# Altium project CCS_v4.PrjPcb
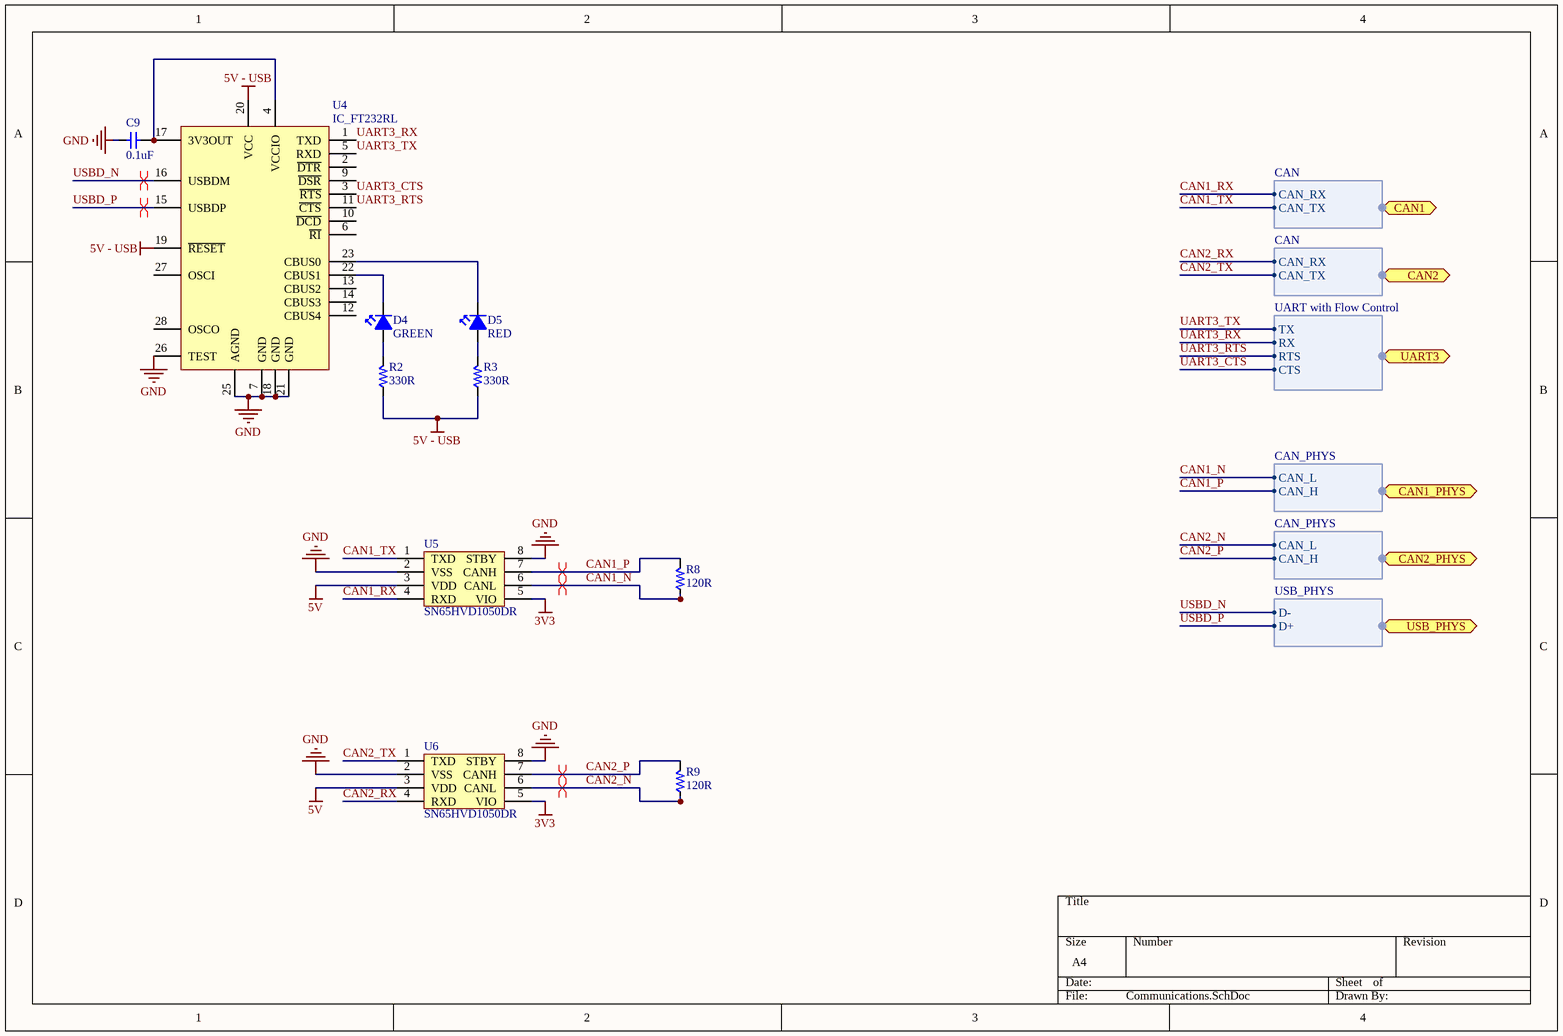
[diagram p0: Communications.SchDoc]
5 sheets, 78 parts. Net scope: flat (ports and power ports of the same name join across sheets).
Board file: CCS_V4.0.PcbDoc
Sheets:
  Communications.SchDoc
  Connectors.SchDoc
  MCU.SchDoc
  Power.SchDoc
  12V Input Circuitry.SchDoc

## Sheet Communications.SchDoc
size A4

### Parts
C9  value 0.1uF  [PCB_GENERIC_SMD_0603]  (hidden comment: C060-000U1-00)
D4  Color: GREEN  [SMD_0603_LED]  (hidden comment: D060-000G2-00)
D5  Color: RED  [SMD_0603_LED]  (hidden comment: D060-000R2-00)
R2  value 330R  [PCB_GENERIC_SMD_0603]  (hidden comment: R060-00331-05)
R3  value 330R  [PCB_GENERIC_SMD_0603]  (hidden comment: R060-00331-05)
R8  value 120R  [PCB_GENERIC_SMD_0603]  (hidden comment: R060-00121-05)
R9  value 120R  [PCB_GENERIC_SMD_0603]  (hidden comment: R060-00121-05)
U4  IC_FT232RL  [SSOP-28]
U5  SN65HVD1050DR  [SOIC127P600X175-8N]
U6  SN65HVD1050DR  [SOIC127P600X175-8N]

### Ports
CAN1 (harness CAN), CAN1_PHYS (harness CAN_PHYS), CAN2 (harness CAN), CAN2_PHYS (harness CAN_PHYS), UART3 (harness UART with Flow Control), USB_PHYS (harness USB_PHYS)

### Harnesses
CAN_PHYS: CAN_L, CAN_H
CAN: CAN_RX, CAN_TX
UART with Flow Control: TX, RX, RTS, CTS
USB_PHYS: D-, D+

### Nets
3V3: U5.5(VIO) U6.5(VIO)
5V: U5.3(VDD) U6.3(VDD)
5V - USB: R2.1 R3.1 U4.19(~{RESET}) U4.20(VCC)
GND: C9.1 U4.7(GND) U4.18(GND) U4.21(GND) U4.25(AGND) U4.26(TEST) U5.2(VSS) U5.8(STBY) U6.2(VSS) U6.8(STBY)
NC: U4.8(NC) U4.24(NC)
CAN1_N: R8.1 U5.6(CANL) ; port CAN1_PHYS.CAN_L
CAN1_P: R8.2 U5.7(CANH) ; port CAN1_PHYS.CAN_H
CAN1_RX: U5.4(RXD) ; port CAN1.CAN_RX
CAN1_TX: U5.1(TXD) ; port CAN1.CAN_TX
CAN2_N: R9.1 U6.6(CANL) ; port CAN2_PHYS.CAN_L
CAN2_P: R9.2 U6.7(CANH) ; port CAN2_PHYS.CAN_H
CAN2_RX: U6.4(RXD) ; port CAN2.CAN_RX
CAN2_TX: U6.1(TXD) ; port CAN2.CAN_TX
UART3_CTS: U4.3(~{RTS}) ; port UART3.CTS
UART3_RTS: U4.11(~{CTS}) ; port UART3.RTS
UART3_RX: U4.1(TXD) ; port UART3.RX
UART3_TX: U4.5(RXD) ; port UART3.TX
USBD_N: U4.16(USBDM) ; port USB_PHYS.D-
USBD_P: U4.15(USBDP) ; port USB_PHYS.D+
NetC9_2: C9.2 U4.4(VCCIO) U4.17(3V3OUT)
NetD4_1: D4.1(K) U4.22(CBUS1)
NetD4_2: D4.2(A) R2.2
NetD5_1: D5.1(K) U4.23(CBUS0)
NetD5_2: D5.2(A) R3.2

Not connected (* = marked no-connect by the designer): U4 2(~{DTR}) 6(~{RI}) 9(~{DSR}) 10(~{DCD}) 12(CBUS4) 13(CBUS2) 14(CBUS3) 27(OSCI) 28(OSCO)

### Layout directives
differential pair: CAN1_N, CAN1_P, CAN2_N, CAN2_P, USBD_N, USBD_P

### Library data of the parts
C9 = C060-000U1-00: CAP CER 0603 0.1uF 16V X5R 20%; Tolerance: 20%; Voltage: 16V; Package: 0603
D4 = D060-000G2-00: LED 0603 GREEN 3.2Vf 20mA; Supplier 1: Digi-Key; Supplier Part Number 1: 732-4971-1-ND
D5 = D060-000R2-00: LED 0603 RED 2Vf 20mA; Supplier 1: Digi-Key; Supplier Part Number 1: 732-4978-1-ND
R2 R3 = R060-00331-05: RES 0603 330ohm 5% 63mW; Tolerance: 5%; Power: 63mW; Package: 0603
R8 R9 = R060-00121-05: RES 0603 120ohm 5% 63mW; Tolerance: 5%; Power: 63mW; Package: 0603
U4 = IC_FT232RL: FT232R USB UART; Manufacturer: *; Note: *; ManufacturerPartNo: *
U5 U6 = SN65HVD1050DR: IC EMC CAN TRANSCEIVER 8-SOIC; Supplier 1: Digi-Key; Supplier Part Number 1: 296-26335-1-ND

## Sheet Connectors.SchDoc
size A4
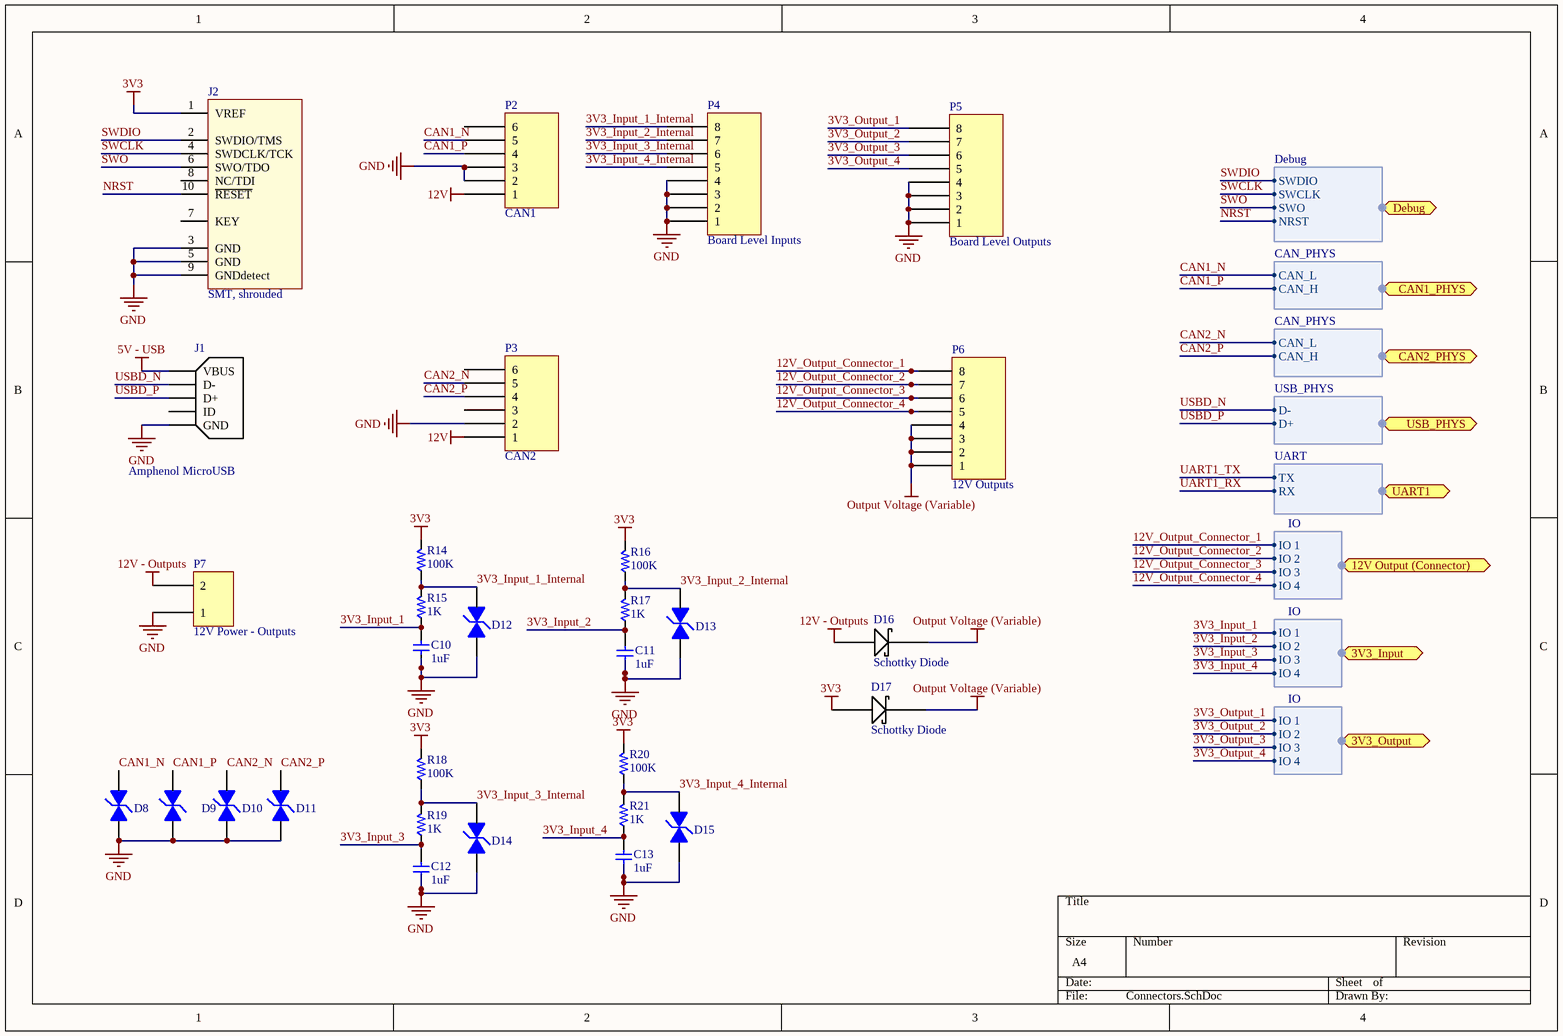
[diagram p1: Connectors.SchDoc]

### Parts
C10  value 1uF  [PCB_GENERIC_SMD_0603]  (hidden comment: C060-0001U-00)
C11  value 1uF  [PCB_GENERIC_SMD_0603]  (hidden comment: C060-0001U-00)
C12  value 1uF  [PCB_GENERIC_SMD_0603]  (hidden comment: C060-0001U-00)
C13  value 1uF  [PCB_GENERIC_SMD_0603]  (hidden comment: C060-0001U-00)
D8  TVS Diode  [TVS Diode]  (value not drawn)
D9  TVS Diode  [TVS Diode]  (value not drawn)
D10  TVS Diode  [TVS Diode]  (value not drawn)
D11  TVS Diode  [TVS Diode]  (value not drawn)
D12  TVS Diode  [TVS Diode]  (value not drawn)
D13  TVS Diode  [TVS Diode]  (value not drawn)
D14  TVS Diode  [TVS Diode]  (value not drawn)
D15  TVS Diode  [TVS Diode]  (value not drawn)
D16  Schottky Diode  [ON Semi Schottky Diode - MBRM110LT1G]
D17  Schottky Diode  [ON Semi Schottky Diode - MBRM110LT1G]
J1  Amphenol MicroUSB  [Amphenol MicroUSB]
J2  SMT, shrouded  [CONN-50mil-10POS-SMD]
P2  CAN1  [PCB_MLX_MICROFIT_3X2]
P3  CAN2  [PCB_MLX_MICROFIT_3X2]
P4  Board Level Inputs  [PCB_MLX_MICROFIT_4X2]
P5  Board Level Outputs  [PCB_MLX_MICROFIT_4X2]
P6  12V Outputs  [PCB_MLX_MICROFIT_4X2]
P7  12V Power - Outputs  [Molex Mini-Fit Jr 2x1]
R14  value 100K  [PCB_GENERIC_SMD_0603]  (hidden comment: R060-00104-05)
R15  value 1K  [PCB_GENERIC_SMD_0603]  (hidden comment: R060-00102-05)
R16  value 100K  [PCB_GENERIC_SMD_0603]  (hidden comment: R060-00104-05)
R17  value 1K  [PCB_GENERIC_SMD_0603]  (hidden comment: R060-00102-05)
R18  value 100K  [PCB_GENERIC_SMD_0603]  (hidden comment: R060-00104-05)
R19  value 1K  [PCB_GENERIC_SMD_0603]  (hidden comment: R060-00102-05)
R20  value 100K  [PCB_GENERIC_SMD_0603]  (hidden comment: R060-00104-05)
R21  value 1K  [PCB_GENERIC_SMD_0603]  (hidden comment: R060-00102-05)

### Ports
3V3_Input (harness IO), 3V3_Output (harness IO), 12V Output (Connector) (harness IO), CAN1_PHYS (harness CAN_PHYS), CAN2_PHYS (harness CAN_PHYS), Debug (harness Debug), UART1 (harness UART), USB_PHYS (harness USB_PHYS)

### Harnesses
Debug: SWDIO, SWCLK, SWO, NRST
CAN_PHYS: CAN_L, CAN_H
USB_PHYS: D-, D+
UART: TX, RX
IO: IO 1, IO 2, IO 3, IO 4

### Nets
3V3: D17.2 J2.1(VREF) R14.2 R16.2 R18.2 R20.2
5V - USB: J1.1(VBUS)
12V: P2.1 P3.1
12V - Outputs: D16.2 P7.2
GND: C10.1 C11.1 C12.1 C13.1 D8.2 D9.2 D10.2 D11.2 D12.2 D13.2 D14.2 D15.2 J1.5(GND) J2.3(GND) J2.5(GND) J2.9(GNDdetect) P2.2 P2.3 P3.2 P4.1 P4.2 P4.3 P4.4 P5.1 P5.2 P5.3 P5.4 P7.1
Output Voltage (Variable): D16.1 D17.1 P6.1 P6.2 P6.3 P6.4
3V3_Input_1: C10.2 R15.1 ; port 3V3_Input.IO 1
3V3_Input_1_Internal: D12.1 P4.8 R14.1 R15.2
3V3_Input_2: C11.2 R17.1 ; port 3V3_Input.IO 2
3V3_Input_2_Internal: D13.1 P4.7 R16.1 R17.2
3V3_Input_3: C12.2 R19.1 ; port 3V3_Input.IO 3
3V3_Input_3_Internal: D14.1 P4.6 R18.1 R19.2
3V3_Input_4: C13.2 R21.1 ; port 3V3_Input.IO 4
3V3_Input_4_Internal: D15.1 P4.5 R20.1
3V3_Output_1: P5.8 ; port 3V3_Output.IO 1
3V3_Output_2: P5.7 ; port 3V3_Output.IO 2
3V3_Output_3: P5.6 ; port 3V3_Output.IO 3
3V3_Output_4: P5.5 ; port 3V3_Output.IO 4
12V_Output_Connector_1: P6.8 ; port 12V Output (Connector).IO 1
12V_Output_Connector_2: P6.7 ; port 12V Output (Connector).IO 2
12V_Output_Connector_3: P6.6 ; port 12V Output (Connector).IO 3
12V_Output_Connector_4: P6.5 ; port 12V Output (Connector).IO 4
CAN1_N: D8.1 P2.5 ; port CAN1_PHYS.CAN_L
CAN1_P: D9.1 P2.4 ; port CAN1_PHYS.CAN_H
CAN2_N: D10.1 P3.5 ; port CAN2_PHYS.CAN_L
CAN2_P: D11.1 P3.4 ; port CAN2_PHYS.CAN_H
NRST: J2.10(~{RESET}) ; port Debug.NRST
SWCLK: J2.4(SWDCLK/TCK) ; port Debug.SWCLK
SWDIO: J2.2(SWDIO/TMS) ; port Debug.SWDIO
SWO: J2.6(SWO/TDO) ; port Debug.SWO
USBD_N: J1.2(D-) ; port USB_PHYS.D-
USBD_P: J1.3(D+) ; port USB_PHYS.D+

Not connected (* = marked no-connect by the designer): J1 4(ID); J2 7(KEY) 8(NC/TDI); P2 6; P3 3 6; R21 2

### Library data of the parts
C10-C13 = C060-0001U-00: CAP CER 0603 1uF 16V X5R 20%; Tolerance: 20%; Voltage: 16V; Package: 0603
D8-D15 = TVS Diode: Manufacturer: Bourns; Manufacturer ID: CDSOD323-T03SC
D16 D17 = ON Semi Schottky Diode - MBRM110LT1G
J1 = Amphenol MicroUSB - 609-4618-1-ND
J2 = conn_0.050"_cortexM: ARM Cortex-M 10pin connector,shrouded,SMT; Supplier 1: Digi-Key; Supplier Part Number 1: 1175-1629-ND
P2 P3 = SCH_MLX_MICROFIT_3X2
P4-P6 = SCH_MLX_MICROFIT_4X2: Molex Microfit Connector 4x2
P7 = Molex Mini-Fit 1x2
R14 R16 R18 R20 = R060-00104-05: RES 0603 100K 5% 63mW; Tolerance: 5%; Power: 63mW; Package: 0603
R15 R17 R19 R21 = R060-00102-05: RES 0603 1K 5% 63mW; Tolerance: 5%; Power: 63mW; Package: 0603

## Sheet MCU.SchDoc
size A4
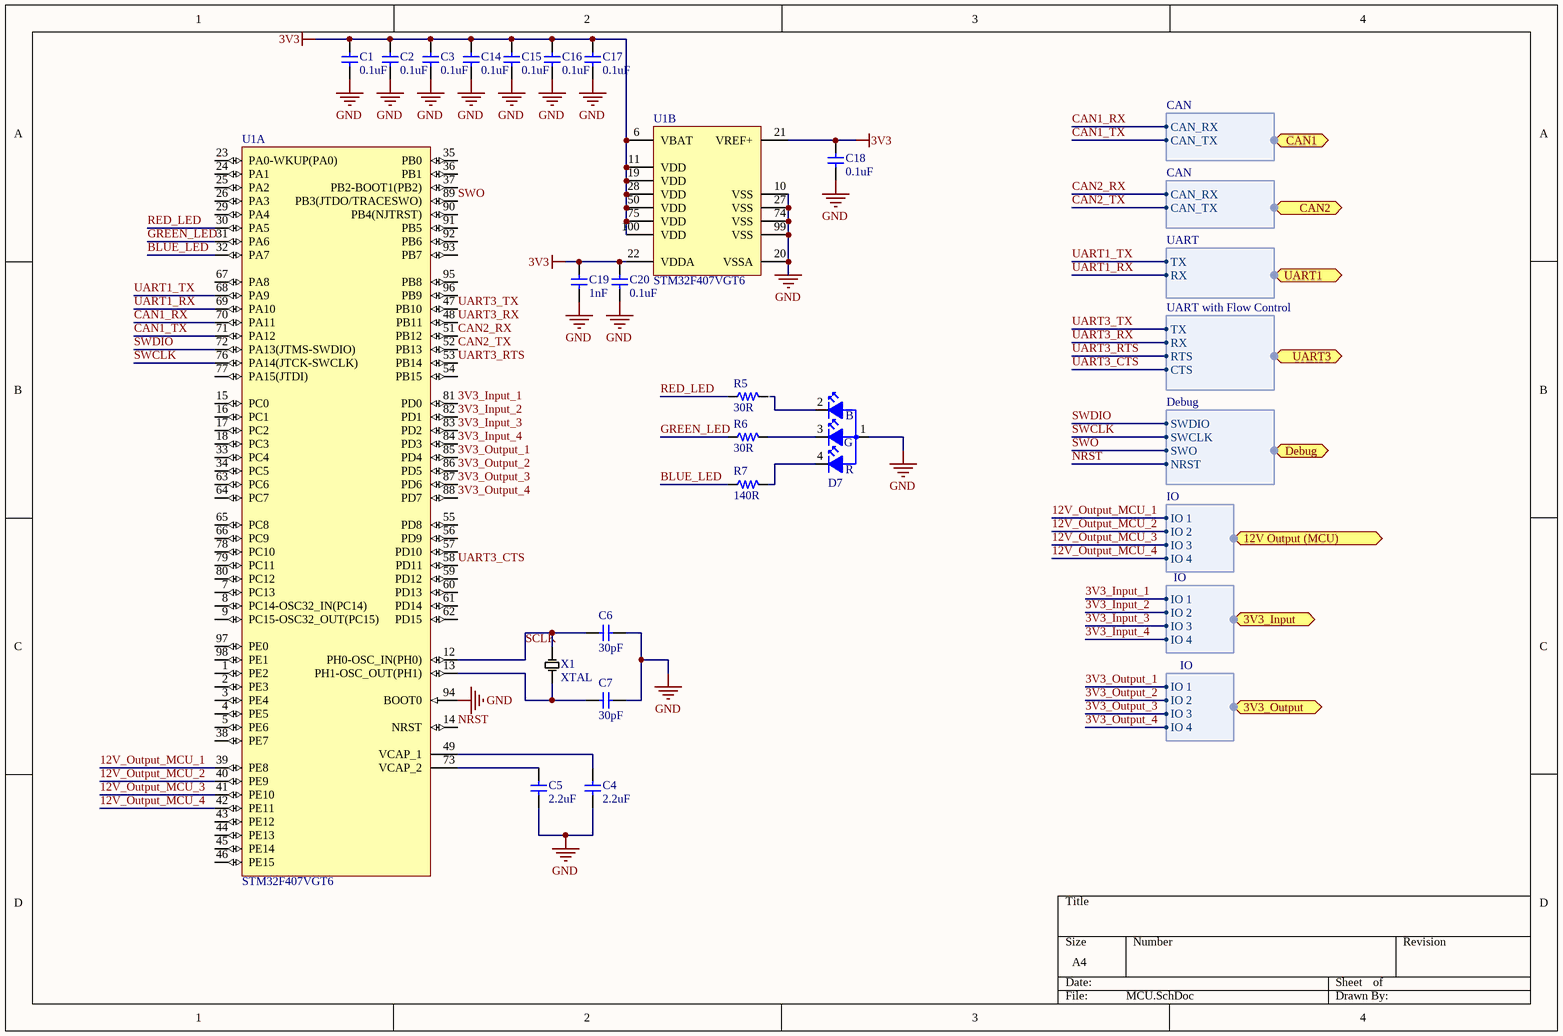
[diagram p2: MCU.SchDoc]

### Parts
C1  value 0.1uF  [PCB_GENERIC_SMD_0603]  (hidden comment: C060-000U1-00)
C2  value 0.1uF  [PCB_GENERIC_SMD_0603]  (hidden comment: C060-000U1-00)
C3  value 0.1uF  [PCB_GENERIC_SMD_0603]  (hidden comment: C060-000U1-00)
C4  value 2.2uF  [PCB_GENERIC_SMD_0603]  (hidden comment: C060-002U2-00)
C5  value 2.2uF  [PCB_GENERIC_SMD_0603]  (hidden comment: C060-002U2-00)
C6  value 30pF  [PCB_GENERIC_SMD_0603]  (hidden comment: C060-0030P-00)
C7  value 30pF  [PCB_GENERIC_SMD_0603]  (hidden comment: C060-0030P-00)
C14  value 0.1uF  [PCB_GENERIC_SMD_0603]  (hidden comment: C060-000U1-00)
C15  value 0.1uF  [PCB_GENERIC_SMD_0603]  (hidden comment: C060-000U1-00)
C16  value 0.1uF  [PCB_GENERIC_SMD_0603]  (hidden comment: C060-000U1-00)
C17  value 0.1uF  [PCB_GENERIC_SMD_0603]  (hidden comment: C060-000U1-00)
C18  value 0.1uF  [PCB_GENERIC_SMD_0603]  (hidden comment: C060-000U1-00)
C19  value 1nF  [PCB_GENERIC_SMD_0603]  (hidden comment: C060-0001N-00)
C20  value 0.1uF  [PCB_GENERIC_SMD_0603]  (hidden comment: C060-000U1-00)
D7  D0S4-000CR-00  [CLMVB-FKA]  (value not drawn)
R5  value 30R  [PCB_GENERIC_SMD_0603]  (hidden comment: R060-00300-05)
R6  value 30R  [PCB_GENERIC_SMD_0603]  (hidden comment: R060-00300-05)
R7  value 140R  [PCB_GENERIC_SMD_0603]  (hidden comment: R060-00141-05)
U1  STM32F407VGT6  [STM-LQFP100_M]  (parts A,B of 2)
X1  XTAL  [CRYSTAL_8MHZ]

### Ports
3V3_Input (harness IO), 3V3_Output (harness IO), 12V Output (MCU) (harness IO), CAN1 (harness CAN), CAN2 (harness CAN), Debug (harness Debug), UART1 (harness UART), UART3 (harness UART with Flow Control)

### Harnesses
CAN: CAN_RX, CAN_TX
Debug: SWDIO, SWCLK, SWO, NRST
UART with Flow Control: TX, RX, RTS, CTS
UART: TX, RX
IO: IO 1, IO 2, IO 3, IO 4

### Nets
3V3: C1.2 C2.2 C3.2 C14.2 C15.2 C16.2 C17.2 C18.2 C19.2 C20.2 U1.6(VBAT) U1.11(VDD) U1.19(VDD) U1.21(VREF+) U1.22(VDDA) U1.28(VDD) U1.50(VDD) U1.75(VDD) U1.100(VDD)
GND: C1.1 C2.1 C3.1 C4.1 C5.1 C6.2 C7.2 C14.1 C15.1 C16.1 C17.1 C18.1 C19.1 C20.1 D7.1(Red) U1.10(VSS) U1.20(VSSA) U1.27(VSS) U1.74(VSS) U1.94(BOOT0) U1.99(VSS)
3V3_Input_1: U1.81(PD0) ; port 3V3_Input.IO 1
3V3_Input_2: U1.82(PD1) ; port 3V3_Input.IO 2
3V3_Input_3: U1.83(PD2) ; port 3V3_Input.IO 3
3V3_Input_4: U1.84(PD3) ; port 3V3_Input.IO 4
3V3_Output_1: U1.85(PD4) ; port 3V3_Output.IO 1
3V3_Output_2: U1.86(PD5) ; port 3V3_Output.IO 2
3V3_Output_3: U1.87(PD6) ; port 3V3_Output.IO 3
3V3_Output_4: U1.88(PD7) ; port 3V3_Output.IO 4
12V_Output_MCU_1: U1.39(PE8) ; port 12V Output (MCU).IO 1
12V_Output_MCU_2: U1.40(PE9) ; port 12V Output (MCU).IO 2
12V_Output_MCU_3: U1.41(PE10) ; port 12V Output (MCU).IO 3
12V_Output_MCU_4: U1.42(PE11) ; port 12V Output (MCU).IO 4
BLUE_LED: R7.1 U1.32(PA7)
CAN1_RX: U1.70(PA11) ; port CAN1.CAN_RX
CAN1_TX: U1.71(PA12) ; port CAN1.CAN_TX
CAN2_RX: U1.51(PB12) ; port CAN2.CAN_RX
CAN2_TX: U1.52(PB13) ; port CAN2.CAN_TX
GREEN_LED: R6.1 U1.31(PA6)
NRST: U1.14(NRST) ; port Debug.NRST
RED_LED: R5.1 U1.30(PA5)
SCLK: C6.1 U1.12(PH0-OSC_IN(PH0)) X1.1
SWCLK: U1.76(PA14(JTCK-SWCLK)) ; port Debug.SWCLK
SWDIO: U1.72(PA13(JTMS-SWDIO)) ; port Debug.SWDIO
SWO: U1.89(PB3(JTDO/TRACESWO)) ; port Debug.SWO
UART1_RX: U1.69(PA10) ; port UART1.RX
UART1_TX: U1.68(PA9) ; port UART1.TX
UART3_CTS: U1.58(PD11) ; port UART3.CTS
UART3_RTS: U1.53(PB14) ; port UART3.RTS
UART3_RX: U1.48(PB11) ; port UART3.RX
UART3_TX: U1.47(PB10) ; port UART3.TX
NetC4_2: C4.2 U1.49(VCAP_1)
NetC5_2: C5.2 U1.73(VCAP_2)
NetC7_1: C7.1 U1.13(PH1-OSC_OUT(PH1)) X1.2
NetD7_3: D7.3(Blue) R6.2
NetD7_4: D7.4 R7.2

Not connected (* = marked no-connect by the designer): D7 2(Green); R5 2; U1 1(PE2) 2(PE3) 3(PE4) 4(PE5) 5(PE6) 7(PC13) 8(PC14-OSC32_IN(PC14)) 9(PC15-OSC32_OUT(PC15)) 15(PC0) 16(PC1) 17(PC2) 18(PC3) 23(PA0-WKUP(PA0)) 24(PA1) 25(PA2) 26(PA3) 29(PA4) 33(PC4) 34(PC5) 35(PB0) 36(PB1) 37(PB2-BOOT1(PB2)) 38(PE7) 43(PE12) 44(PE13) 45(PE14) 46(PE15) 54(PB15) 55(PD8) 56(PD9) 57(PD10) 59(PD12) 60(PD13) 61(PD14) 62(PD15) 63(PC6) 64(PC7) 65(PC8) 66(PC9) 67(PA8) 77(PA15(JTDI)) 78(PC10) 79(PC11) 80(PC12) 90(PB4(NJTRST)) 91(PB5) 92(PB6) 93(PB7) 95(PB8) 96(PB9) 97(PE0) 98(PE1)

### Notes on the sheet
- (in symbol D0S4-000CR-00) B; G; R

### Library data of the parts
C1-C3 C14-C18 C20 = C060-000U1-00: CAP CER 0603 0.1uF 16V X5R 20%; Tolerance: 20%; Voltage: 16V; Package: 0603
C4 C5 = C060-002U2-00: CAP CER 0603 2.2uF 16V X5R 20%; Tolerance: 20%; Voltage: 16V; Package: 0603
C6 C7 = C060-0030P-00: CAP CER 0603 30pF 50V NP0 5%; Tolerance: 5%; Voltage: 50V; Package: 0603
C19 = C060-0001N-00: CAP CER 0603 1nF 50V X7R 10%; Tolerance: 10%; Voltage: 50V; Package: 0603
D7 = D0S4-000CR-00: LED 4SMD RGB 2Vf 3Vf 3Vf 20mA 10mA 10mA; Supplier 1: Digi-Key; Supplier Part Number 1: CLMVB-FKA-CFHEHLCBB7A363CT-ND; Color: RGB
R5 R6 = R060-00300-05: RES 0603 30ohm 5% 100mW; Tolerance: 5%; Power: 100mW; Package: 0603
R7 = R060-00141-05: RES 0603 140ohm 5% 63mW; Tolerance: 5%; Power: 63mW; Package: 0603
U1 = STM32F407VGT6: ARM Cortex-M4 32-bit MCU+FPU, 210 DMIPS, 1024 kB Flash, 192 kB Internal RAM, 82 I/Os, 100-pin LQFP, -40 to 85 degC, Tray; Manufacturer: STMicroelectronics; D/A Converter: 2x12-bit; FLASH Size (Prog) (kB): 1024; I/Os (High Current): 82; Internal RAM Size (kB): 192; Operating Frequency(F) (Processor speed) (MHz): 168; Supply Voltage(Vcc) max (V): 3.6; Supply Voltage(Vcc) min (V): 1.8; DatasheetVersion: Rev. 4; PackageVersion: Rev. 1, 06/2013; PackageReference: LQFP100; PackageDescription: 100-Pin Low Profile Quad Flat Package, 14 x 14 mm Body, 0.5 mm Pitch; Supplier 1: Digi-Key; Supplier Part Number 1: 497-11605-ND; Supplier 2: Farnell; Supplier Part Number 2: 2064368; Supplier 3: Newark; Supplier Part Number 3: 73T2333; Supplier 4: Mouser; Supplier Part Number 4: 511-STM32F407VGT6; Core: ARM Cortex-M4; Packing: Tray; Mounting Technology: Surface Mount; PartNumber: STM32F407VGT6; ComponentLink1Description: Manufacturer URL; ComponentLink1URL: http://www.st.com/web/en/home.html; ComponentLink2Description: Datasheet; ComponentLink2URL: http://www.st.com/st-web-ui/static/active/en/resource/technical/document/datasheet/DM00037051.pdf; ComponentLink3Description: Package Specification; ComponentLink3URL: http://www.st.com/st-web-ui/static/active/en/resource/technical/document/data_brief/DM00071938.pdf
X1 = Crystal: Frequency: 8MHz

## Sheet Power.SchDoc
size A4
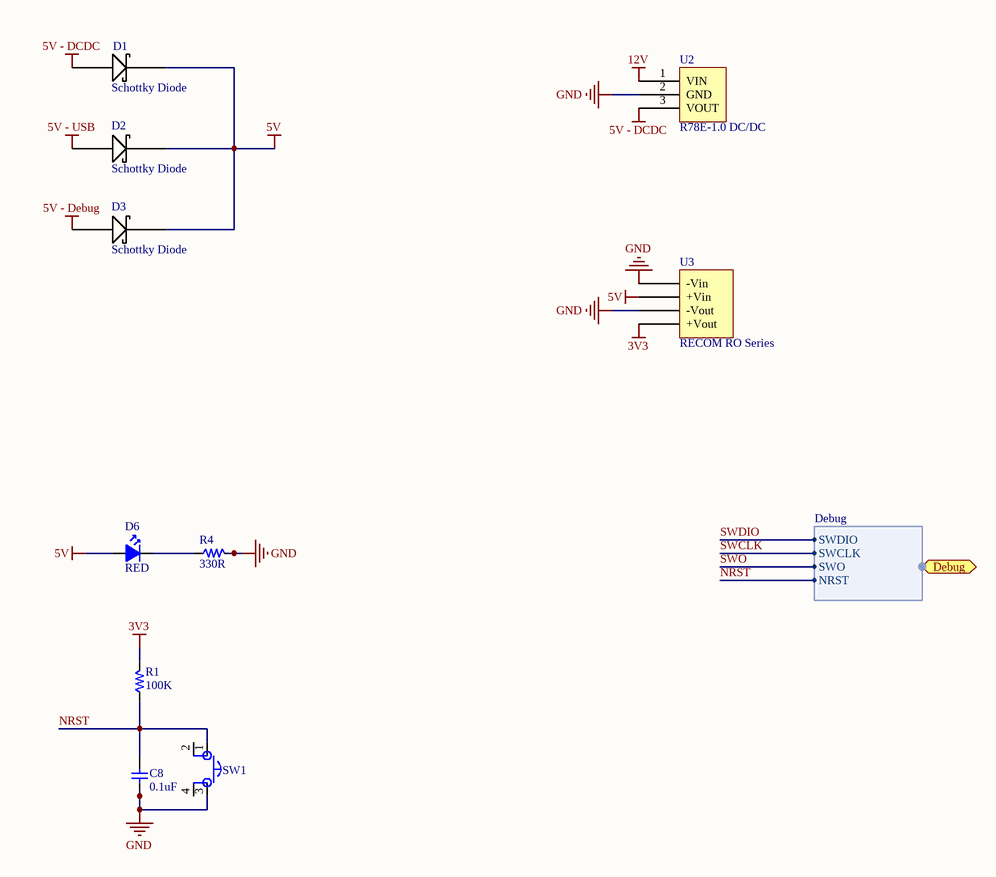
[diagram p3: Power.SchDoc]

### Parts
C8  value 0.1uF  [PCB_GENERIC_SMD_0603]  (hidden comment: C060-000U1-00)
D1  Schottky Diode  [ON Semi Schottky Diode - MBRM110LT1G]
D2  Schottky Diode  [ON Semi Schottky Diode - MBRM110LT1G]
D3  Schottky Diode  [ON Semi Schottky Diode - MBRM110LT1G]
D6  Color: RED  [SMD_0603_LED]  (hidden comment: D060-000R2-00)
R1  value 100K  [PCB_GENERIC_SMD_0603]  (hidden comment: R060-00104-05)
R4  value 330R  [PCB_GENERIC_SMD_0603]  (hidden comment: R060-00331-05)
SW1  Tactile Switch  [C&K 4 pin Tactile Switch]  (value not drawn)
U2  R78E-1.0 DC/DC  [R78-1.0]
U3  RECOM RO Series  [RECOM RO Series 1W DCDC]

### Ports
Debug (harness Debug)

### Harnesses
Debug: SWDIO, SWCLK, SWO, NRST

### Nets
3V3: R1.2 U3.4(+Vout)
5V: D1.1 D2.1 D3.1 D6.2(A) U3.2(+Vin)
5V - DCDC: D1.2 U2.3(VOUT)
5V - Debug: D3.2
5V - USB: D2.2
12V: U2.1(VIN)
GND: C8.1 R4.2 SW1.3 U2.2(GND) U3.1(-Vin) U3.3(-Vout)
NRST: C8.2 R1.1 SW1.1 ; port Debug.NRST
NetD6_1: D6.1(K) R4.1

Not connected (* = marked no-connect by the designer): SW1 2 4

### Library data of the parts
C8 = C060-000U1-00: CAP CER 0603 0.1uF 16V X5R 20%; Tolerance: 20%; Voltage: 16V; Package: 0603
D1-D3 = ON Semi Schottky Diode - MBRM110LT1G
D6 = D060-000R2-00: LED 0603 RED 2Vf 20mA; Supplier 1: Digi-Key; Supplier Part Number 1: 732-4978-1-ND
R1 = R060-00104-05: RES 0603 100K 5% 63mW; Tolerance: 5%; Power: 63mW; Package: 0603
R4 = R060-00331-05: RES 0603 330ohm 5% 63mW; Tolerance: 5%; Power: 63mW; Package: 0603
SW1 = C&K Tactile Switch: Supplier 1: Digi-Key; Supplier Part Number 1: CKN9085CT-ND
U2 = R78E-1.0
U3 = RECOM RO Series DCDC Converter

## Sheet 12V Input Circuitry.SchDoc
size A4
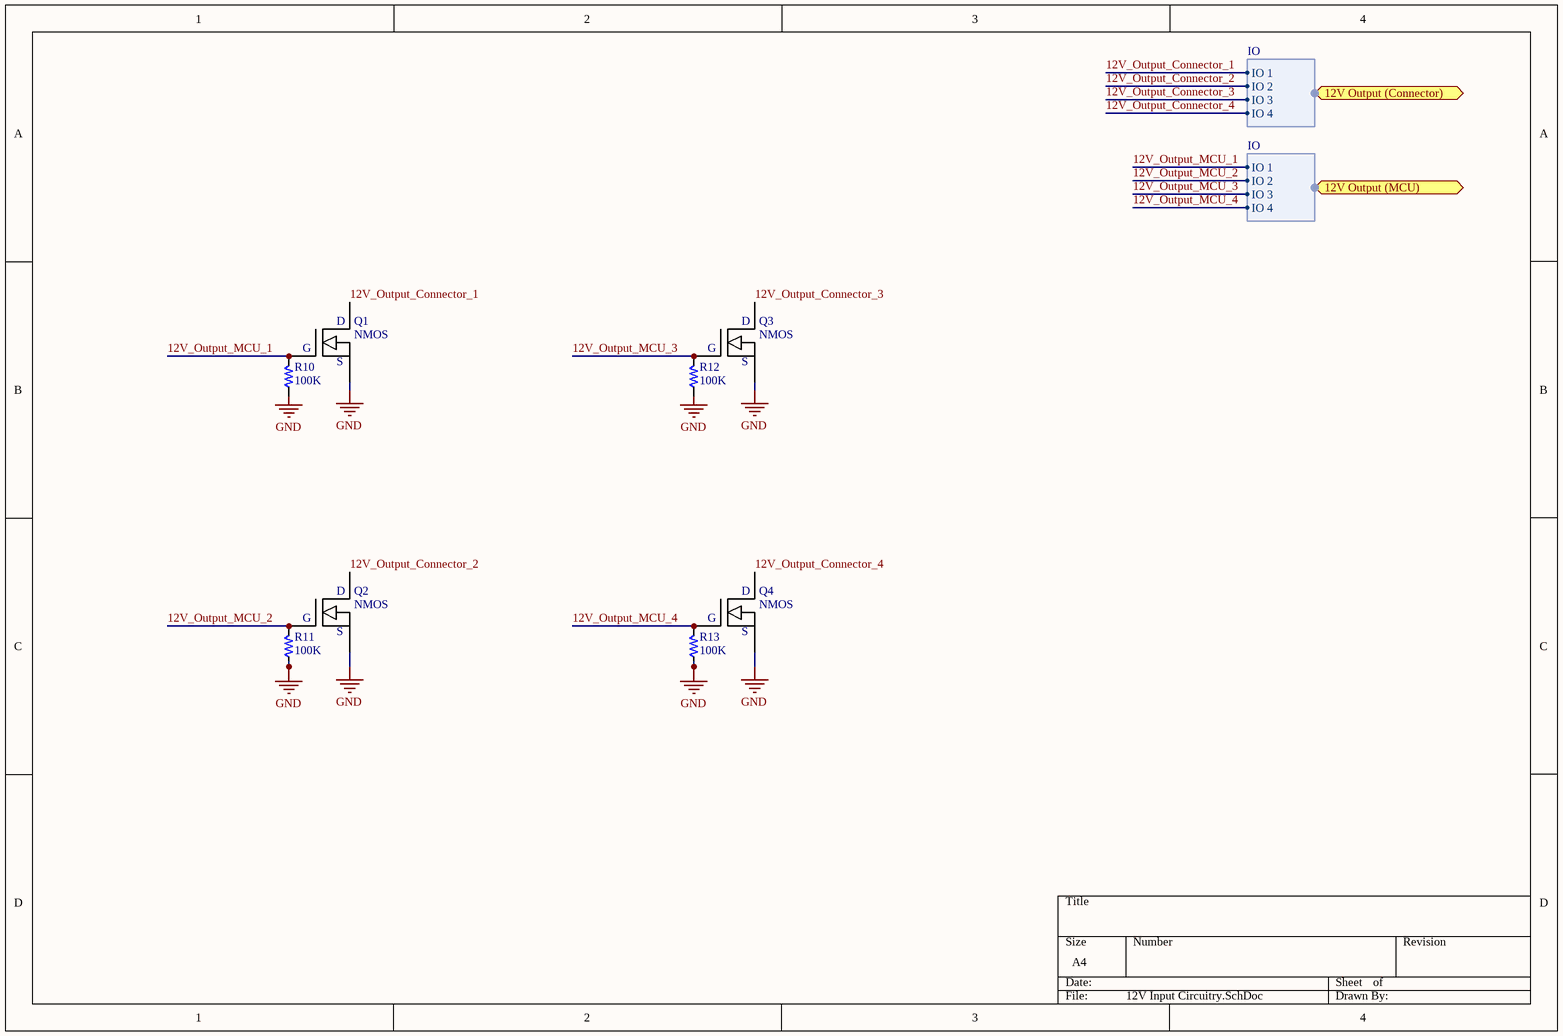
[diagram p4: 12V Input Circuitry.SchDoc]

### Parts
Q1  NMOS  [NMOS - SSM3K333R - SOTFL95P180X88-3M]
Q2  NMOS  [NMOS - SSM3K333R - SOTFL95P180X88-3M]
Q3  NMOS  [NMOS - SSM3K333R - SOTFL95P180X88-3M]
Q4  NMOS  [NMOS - SSM3K333R - SOTFL95P180X88-3M]
R10  value 100K  [PCB_GENERIC_SMD_0603]  (hidden comment: R060-00104-05)
R11  value 100K  [PCB_GENERIC_SMD_0603]  (hidden comment: R060-00104-05)
R12  value 100K  [PCB_GENERIC_SMD_0603]  (hidden comment: R060-00104-05)
R13  value 100K  [PCB_GENERIC_SMD_0603]  (hidden comment: R060-00104-05)

### Ports
12V Output (Connector) (harness IO), 12V Output (MCU) (harness IO)

### Harnesses
IO: IO 1, IO 2, IO 3, IO 4

### Nets
GND: Q1.2(S) Q2.2(S) Q3.2(S) Q4.2(S) R11.1 R13.1
12V_Output_Connector_1: Q1.3(D) ; port 12V Output (Connector).IO 1
12V_Output_Connector_2: Q2.3(D) ; port 12V Output (Connector).IO 2
12V_Output_Connector_3: Q3.3(D) ; port 12V Output (Connector).IO 3
12V_Output_Connector_4: Q4.3(D) ; port 12V Output (Connector).IO 4
12V_Output_MCU_1: Q1.1(G) R10.2 ; port 12V Output (MCU).IO 1
12V_Output_MCU_2: Q2.1(G) R11.2 ; port 12V Output (MCU).IO 2
12V_Output_MCU_3: Q3.1(G) R12.2 ; port 12V Output (MCU).IO 3
12V_Output_MCU_4: Q4.1(G) R13.2 ; port 12V Output (MCU).IO 4

Not connected (* = marked no-connect by the designer): R10 1; R12 1

### Notes on the sheet
- Labels drawn without touching a wire or pin: GND

### Library data of the parts
Q1-Q4 = NMOS - SSM3K333R
R10-R13 = R060-00104-05: RES 0603 100K 5% 63mW; Tolerance: 5%; Power: 63mW; Package: 0603

## Nets that join several sheets
3V3: Communications (U5.5 U6.5), Connectors (6 pins), MCU (19 pins), Power (R1.2 U3.4)
5V: Communications (U5.3 U6.3), Power (5 pins)
5V - USB: Communications (R2.1 R3.1 U4.19 U4.20), Connectors (J1.1), Power (D2.2)
12V: Connectors (P2.1 P3.1), Power (U2.1)
GND: Communications (10 pins), Connectors (28 pins), MCU (21 pins), Power (6 pins), 12V Input Circuitry (6 pins)
3V3_Input_1: Connectors (C10.2 R15.1), MCU (U1.81)
3V3_Input_2: Connectors (C11.2 R17.1), MCU (U1.82)
3V3_Input_3: Connectors (C12.2 R19.1), MCU (U1.83)
3V3_Input_4: Connectors (C13.2 R21.1), MCU (U1.84)
3V3_Output_1: Connectors (P5.8), MCU (U1.85)
3V3_Output_2: Connectors (P5.7), MCU (U1.86)
3V3_Output_3: Connectors (P5.6), MCU (U1.87)
3V3_Output_4: Connectors (P5.5), MCU (U1.88)
12V_Output_Connector_1: Connectors (P6.8), 12V Input Circuitry (Q1.3)
12V_Output_Connector_2: Connectors (P6.7), 12V Input Circuitry (Q2.3)
12V_Output_Connector_3: Connectors (P6.6), 12V Input Circuitry (Q3.3)
12V_Output_Connector_4: Connectors (P6.5), 12V Input Circuitry (Q4.3)
12V_Output_MCU_1: MCU (U1.39), 12V Input Circuitry (Q1.1 R10.2)
12V_Output_MCU_2: MCU (U1.40), 12V Input Circuitry (Q2.1 R11.2)
12V_Output_MCU_3: MCU (U1.41), 12V Input Circuitry (Q3.1 R12.2)
12V_Output_MCU_4: MCU (U1.42), 12V Input Circuitry (Q4.1 R13.2)
CAN1_N: Communications (R8.1 U5.6), Connectors (D8.1 P2.5)
CAN1_P: Communications (R8.2 U5.7), Connectors (D9.1 P2.4)
CAN1_RX: Communications (U5.4), MCU (U1.70)
CAN1_TX: Communications (U5.1), MCU (U1.71)
CAN2_N: Communications (R9.1 U6.6), Connectors (D10.1 P3.5)
CAN2_P: Communications (R9.2 U6.7), Connectors (D11.1 P3.4)
CAN2_RX: Communications (U6.4), MCU (U1.51)
CAN2_TX: Communications (U6.1), MCU (U1.52)
NRST: Connectors (J2.10), MCU (U1.14), Power (C8.2 R1.1 SW1.1)
SWCLK: Connectors (J2.4), MCU (U1.76)
SWDIO: Connectors (J2.2), MCU (U1.72)
SWO: Connectors (J2.6), MCU (U1.89)
UART3_CTS: Communications (U4.3), MCU (U1.58)
UART3_RTS: Communications (U4.11), MCU (U1.53)
UART3_RX: Communications (U4.1), MCU (U1.48)
UART3_TX: Communications (U4.5), MCU (U1.47)
USBD_N: Communications (U4.16), Connectors (J1.2)
USBD_P: Communications (U4.15), Connectors (J1.3)